# Altium schematic sheet Misc.SchDoc
size A4
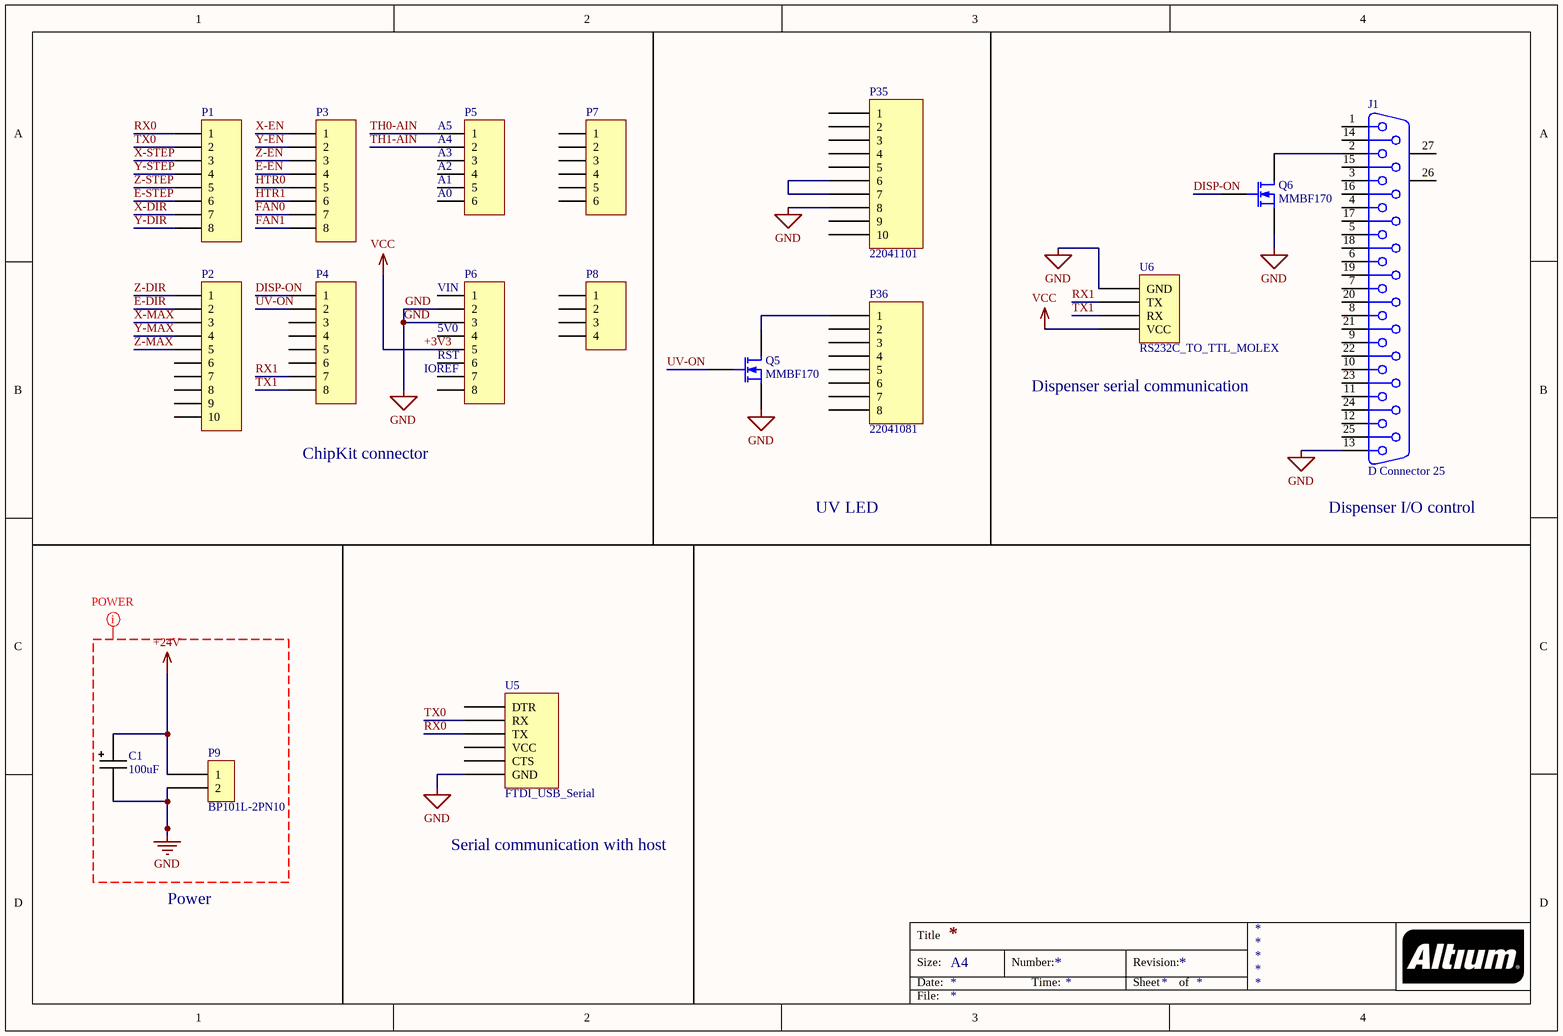
[diagram p0: Misc.SchDoc]

## Parts
C1  Cap_alumi_electrolytic  [EEE-1HA101UP]  (value not drawn)
J1  D Connector 25  [DSUB1.385-2H25A]
P1  (no value)  [HDR1X8]
P2  (no value)  [HDR1X10]
P3  (no value)  [HDR1X8]
P4  (no value)  [HDR1X8]
P5  (no value)  [HDR1X6]
P6  (no value)  [HDR1X8]
P7  (no value)  [HDR1X6]
P8  Header 4  [HDR1X4]  (value not drawn)
P9  BP101L-2PN10  [BP101L-2PN10]
P35  22041101  [PHOENIX_10PIN_MOLEX]
P36  22041081  [PHOENIX_8PIN_MOLEX]
Q5  MMBF170  [MMBF170-SOT95P240X130-3N]
Q6  MMBF170  [MMBF170-SOT95P240X130-3N]
U5  FTDI_USB_Serial  [FTDI_USB_Serial]
U6  RS232C_TO_TTL_MOLEX  [RS232C_TO_TTL_MOLEX]

## Nets
+3V3: P6.5 U6.VCC  [also labelled VCC]
+24V: C1.2 P9.1
GND: C1.1 J1.13 P6.2 P6.3 P9.2 P35.8 Q5.2(S) Q6.2(S) U5.6(GND) U6.GND
DISP-ON: P4.1 Q6.1(G)
E-DIR: P2.2
E-EN: P3.4
E-STEP: P1.6
FAN0: P3.7
FAN1: P3.8
HTR0: P3.5
HTR1: P3.6
RX0: P1.1 U5.3(TX)
RX1: P4.7 U6.TX
TH0-AIN: P5.1
TH1-AIN: P5.2
TX0: P1.2 U5.2(RX)
TX1: P4.8 U6.RX
UV-ON: P4.2 Q5.1(G)
X-DIR: P1.7
X-EN: P3.1
X-MAX: P2.3
X-STEP: P1.3
Y-DIR: P1.8
Y-EN: P3.2
Y-MAX: P2.4
Y-STEP: P1.4
Z-DIR: P2.1
Z-EN: P3.3
Z-MAX: P2.5
Z-STEP: P1.5
NetJ1_2: J1.2 Q6.3(D)
NetP35_6: P35.6 P35.7
NetP36_1: P36.1 Q5.3(D)

Not connected (* = marked no-connect by the designer): J1 1 3 4 5 6 7 8 9 10 11 12 14 15 16 17 18 19 20 21 22 23 24 25 26(MH1) 27(MH2); P2 6 7 8 9 10; P4 3 4 5 6; P5 3 4 5 6; P6 1 4 6 7 8; P7 1 2 3 4 5 6; P8 1 2 3 4; P35 1 2 3 4 5 9 10; P36 2 3 4 5 6 7 8; U5 1(DTR) 4(VCC) 5(CTS)

## Layout directives
net class Power: +24V, GND

## Notes on the sheet
- (near P5) A5
- (near P5) A4
- (near P5) A3
- (near P5) A2
- (near P5) A1
- (near P5) A0
- (near P6) VIN
- (near P6) IOREF
- (near P6) 5V0
- (near P6) RST
- (near U6) Dispenser serial communication
- ChipKit connector
- UV LED
- (near J1) Dispenser I/O control
- Serial communication with host
- Power
- Title
- Size:
- Date:
- Number:
- Time:
- Revision:
- Sheet
- of
- File:
- (in symbol Cap_alumi_electrolytic) 100uF

## Library data of the parts
J1 = D Connector 25: Receptacle Assembly, 25 Position, Right Angle; PackageDocument: U; Positions: 25; Published: 15-Jun-2001; LatestRevisionDate: 17-Jul-2002; LatestRevisionNote: Re-released for DXP Platform.; DatasheetDocument: 19-Mar-1999; PackageReference: 787202; Publisher: Altium Limited; Orientation: Right Angle; Gender: Receptacle
P1 P3 P4 P6 = Header 8: Header, 8-Pin; LatestRevisionDate: 17-Jul-2002; LatestRevisionNote: Re-released for DXP Platform.; Publisher: Altium Limited
P2 = Header 10: Header, 10-Pin; LatestRevisionDate: 17-Jul-2002; LatestRevisionNote: Re-released for DXP Platform.; Publisher: Altium Limited
P5 P7 = Header 6: Header, 6-Pin; LatestRevisionDate: 17-Jul-2002; LatestRevisionNote: Re-released for DXP Platform.; Publisher: Altium Limited
P8 = Header 4: Header, 4-Pin; LatestRevisionDate: 17-Jul-2002; LatestRevisionNote: Re-released for DXP Platform.; Publisher: Altium Limited
P35 = Phoenix_10pin_MOLEX
P36 = Phoenix_8pin_MOLEX